# Altium project LM317.PrjPcb
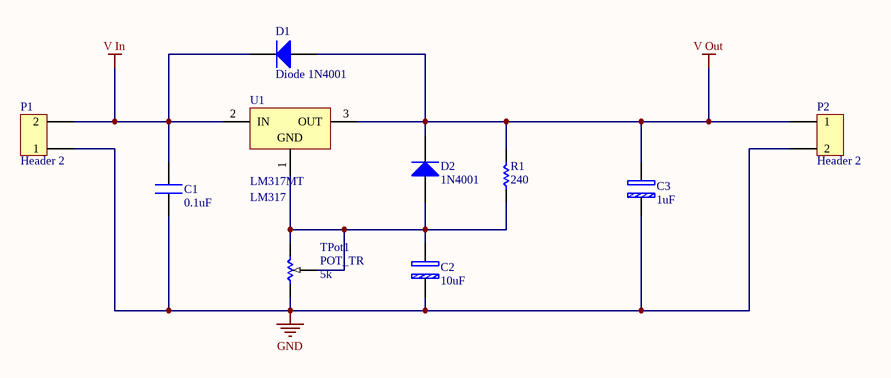
[diagram p0: LM317.SchDoc]
1 sheet, 10 parts. Net scope: global (net labels, ports and power ports of the same name join across sheets).
Board file: LM317.PcbDoc

## Sheet LM317.SchDoc
size A4; SheetNumber: 1; SheetTotal: 1

### Parts
C1  value 0.1uF  [Capacitor]  (hidden comment: CapN03)
C2  value 10uF  [Capacitor_Ch]  (hidden comment: CapCh10u)
C3  value 1uF  [Capacitor_Ch]  (hidden comment: CapCh10u)
D1  Diode 1N4001  [DO-41]
D2  1N4001  [DO-41]
P1  Header 2  [CONNECTOR-B2]
P2  Header 2  [CONNECTOR-B2]
R1  value 240  [Res10mm]  (hidden comment: Res_010)
TPot1  POT_TR  value 5k  [POTENTIOMETER_N_Trimmer]
U1  LM317MT  Foootprint: LM317  [TO220V]

### Nets
GND: C1.1 C2.2 C3.2 P1.1 P2.2 TPot1.1
V In: C1.2 D1.2(K) P1.2 U1.2(IN)
V Out: C3.1 D1.1(A) D2.2(K) P2.1 R1.2 U1.3(OUT)
NetC2_1: C2.1 D2.1(A) R1.1 TPot1.2 TPot1.3 U1.1(ADJ)

### Notes on the sheet
- (in symbol LM317MT) GND

### Library data of the parts
C1 = CapN: Footprint: 03
C2 C3 = CapChN: Footprint: CapCh10uF
D1 D2 = Diode 1N4001: 1 Amp General Purpose Rectifier; Published: 8-Jun-2000; LatestRevisionDate: 17-Jul-2002; LatestRevisionNote: Re-released for DXP Platform.; DatasheetVersion: 1998; PackageVersion: Aug-1999; PackageReference: DO-41; Publisher: Altium Limited; PackageDescription: Diode, Axial; Body 5.2 x 2.7 mm (LxDia. max), Lead Dia. 0.86 mm (max); Code_JEDEC: DO-204-AL; ComponentLink1Description: Manufacturer Link; ComponentLink1URL: http://www.fairchildsemi.com/; ComponentLink2Description: Datasheet; ComponentLink2URL: http://www.fairchildsemi.com/ds/1N%2F1N4001.pdf
P1 P2 = Block_Conn: Header 2 pins; Foootprint: Header 2 Pins; Value: Header 2
U1 = LM317MT: Regulator Voltage
R1 = Res_010: Footprint: R010
TPot1 = POT_TR: Footprint: Pot Trimmer